# EasyEDA Pro project ProPrj_100MHz��ѹ���̽ͷ_2024-07-25.epro, schematic 100MHz高压差分探头-V6

## Sheets
1 充电管理与隔离变换
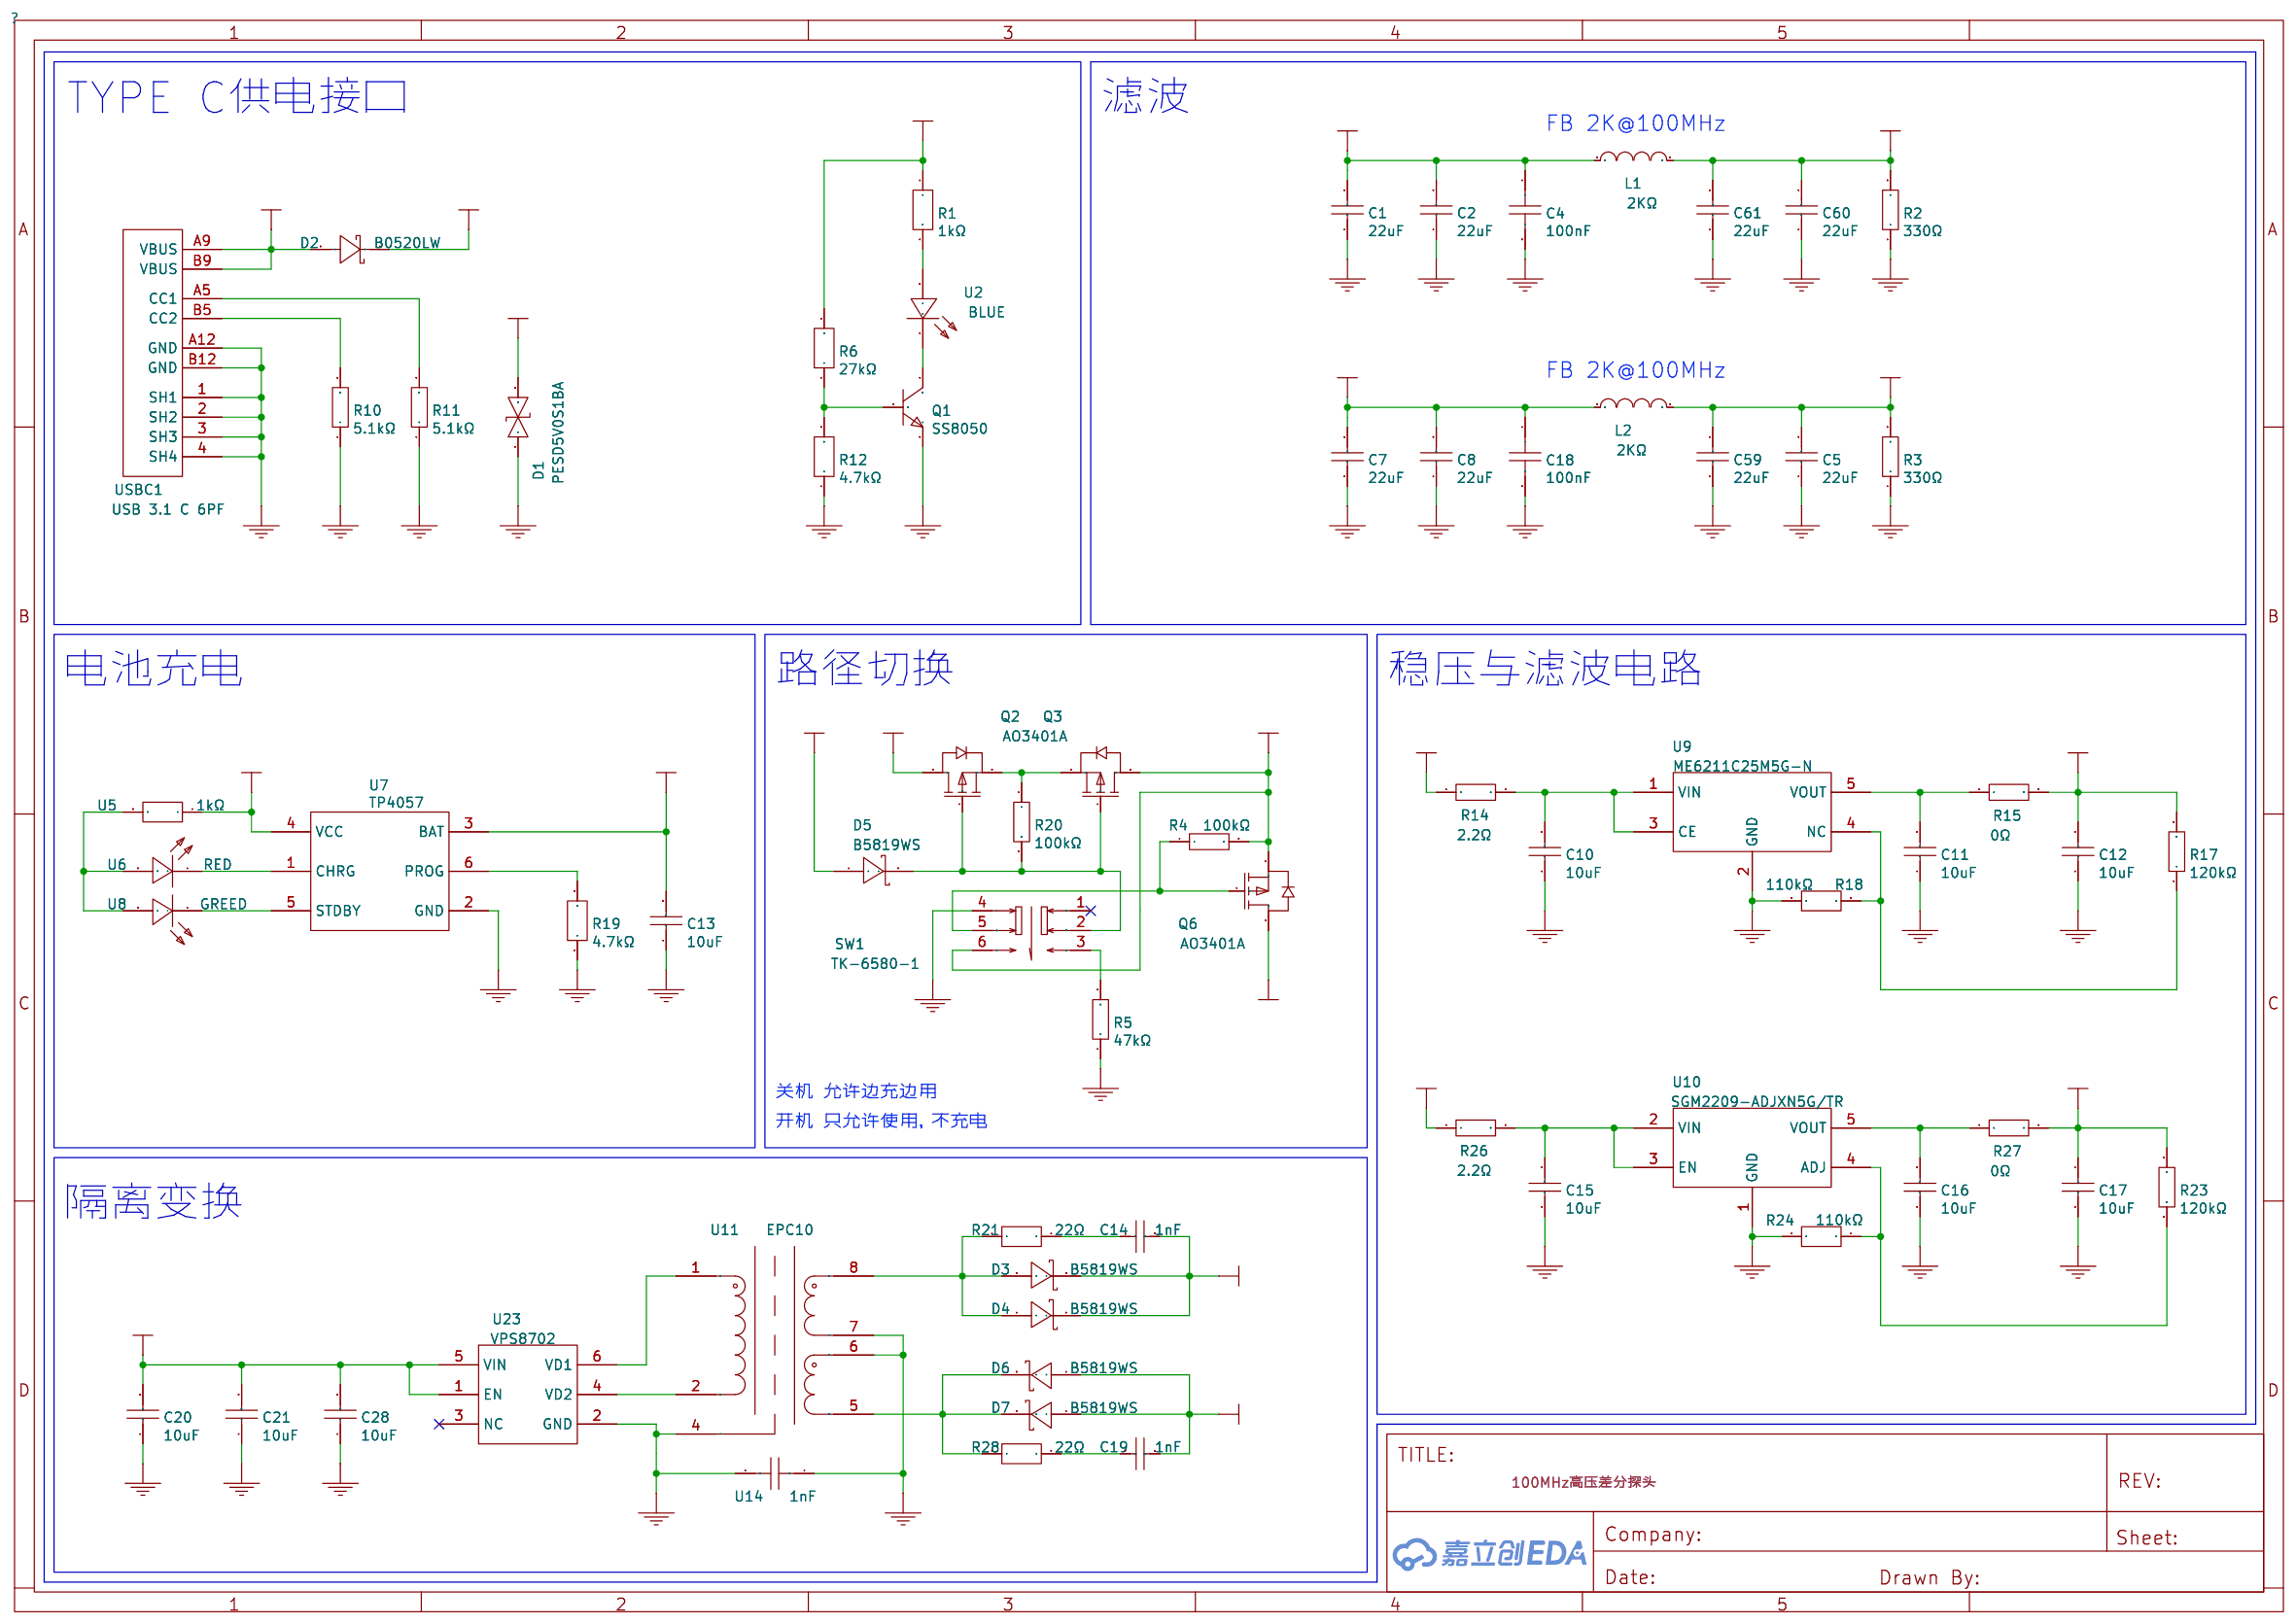
[diagram p0: 充电管理与隔离变换]
2 衰减与放大
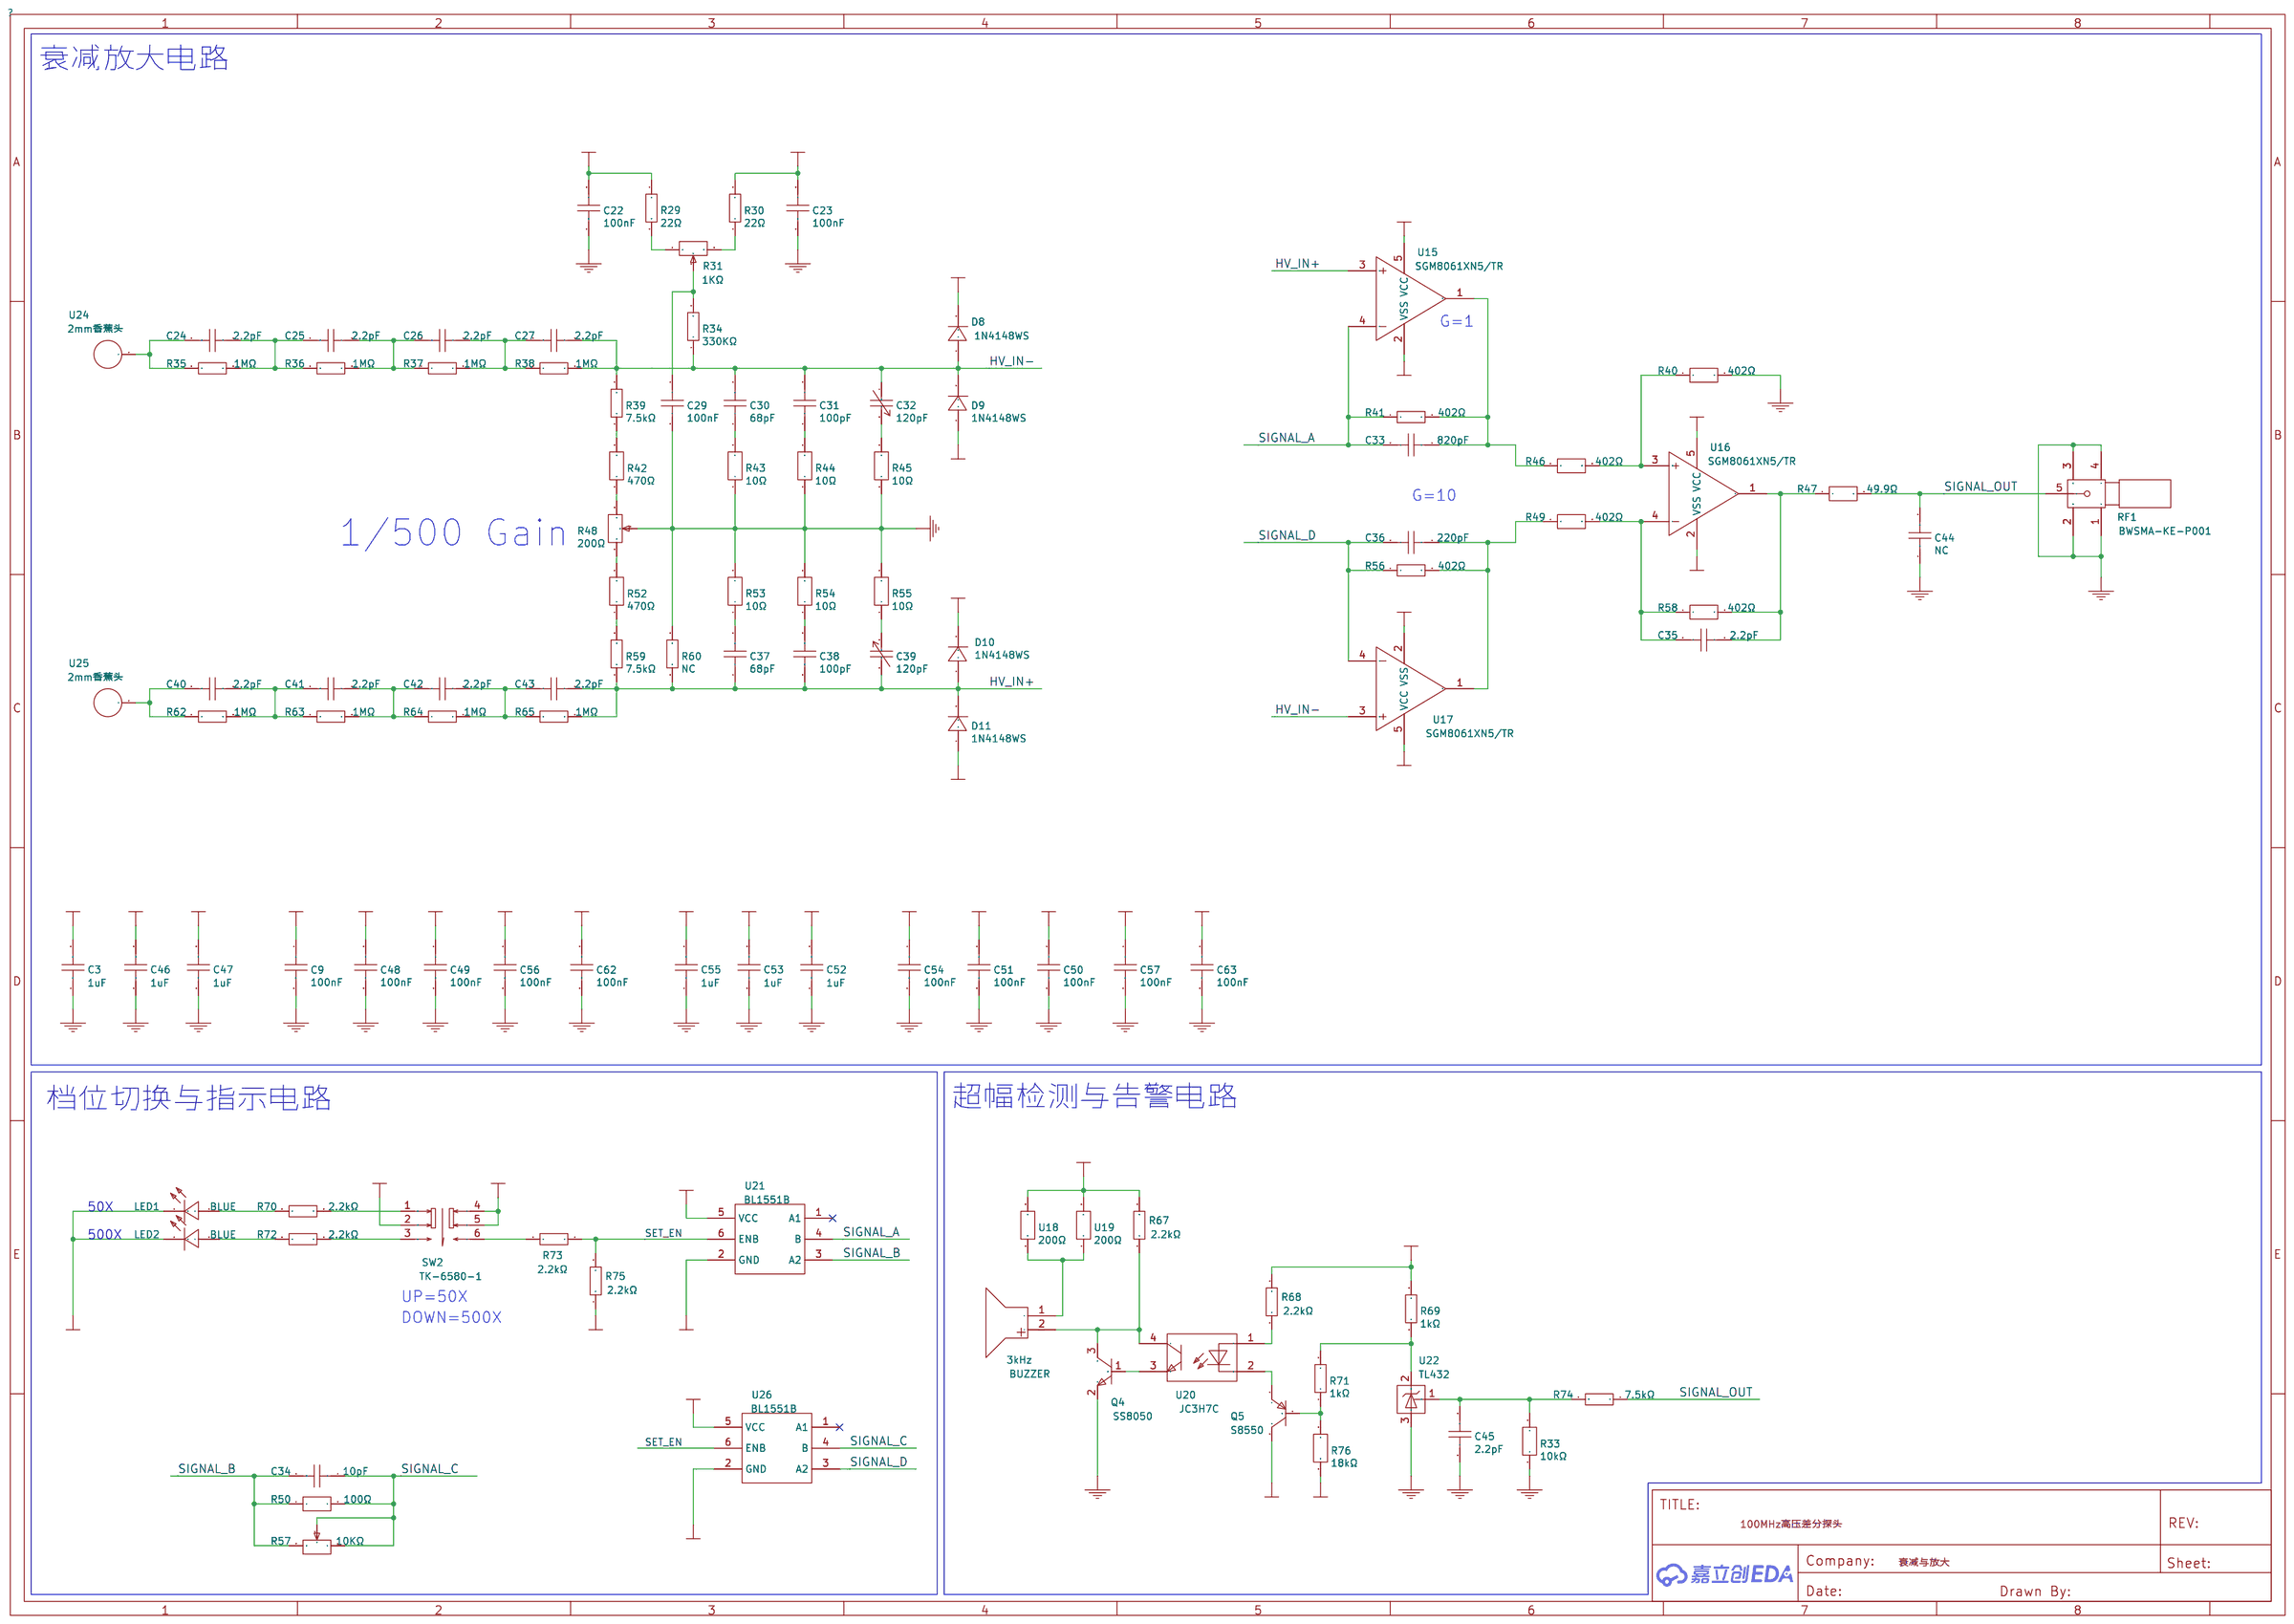
[diagram p1: 衰减与放大]

## Parts
sheet 充电管理与隔离变换
C1  22uF  [C0603]
C2  22uF  [C0603]
C4  100nF  [C0603]
C5  22uF  [C0603]
C7  22uF  [C0603]
C8  22uF  [C0603]
C10  10uF  [C0603]
C11  10uF  [C0603]
C12  10uF  [C0603]
C13  10uF  [C0603]
C14  1nF  [C0603]
C15  10uF  [C0603]
C16  10uF  [C0603]
C17  10uF  [C0603]
C18  100nF  [C0603]
C19  1nF  [C0603]
C20  10uF  [C0603]
C21  10uF  [C0603]
C28  10uF  [C0603]
C59  22uF  [C0603]
C60  22uF  [C0603]
C61  22uF  [C0603]
D1  PESD5V0S1BA  [SOD-323_L1.7-W1.3-LS2.5-FD-1]
D2  B0520LW  [SOD-123FL_L2.7-W1.8-LS3.8-RD]
D3  B5819WS  [SOD-323_L1.7-W1.3-LS2.5-FD-1]
D4  B5819WS  [SOD-323_L1.7-W1.3-LS2.5-FD-1]
D5  B5819WS  [SOD-323_L1.7-W1.3-LS2.5-FD-1]
D6  B5819WS  [SOD-323_L1.7-W1.3-LS2.5-FD-1]
D7  B5819WS  [SOD-323_L1.7-W1.3-LS2.5-FD-1]
L1  2KΩ  [L0603]
L2  2KΩ  [L0603]
Q1  SS8050  [SOT-23_L2.9-W1.3-P1.90-LS2.4-BR]
Q2  AO3401A  [SOT-23_L2.9-W1.3-P1.90-LS2.4-BR]
Q3  AO3401A  [SOT-23_L2.9-W1.3-P1.90-LS2.4-BR]
Q6  AO3401A  [SOT-23_L2.9-W1.3-P1.90-LS2.4-BR]
R1  1kΩ  [R0603]
R2  330Ω  [R0603]
R3  330Ω  [R0603]
R4  100kΩ  [R0603]
R5  47kΩ  [R0603]
R6  27kΩ  [R0603]
R10  5.1kΩ  [R0603]
R11  5.1kΩ  [R0603]
R12  4.7kΩ  [R0603]
R14  2.2Ω  [R0603]
R15  0Ω  [R0603]
R17  120kΩ  [R0603]
R18  110kΩ  [R0603]
R19  4.7kΩ  [R0603]
R20  100kΩ  [R0603]
R21  22Ω  [R0603]
R23  120kΩ  [R0603]
R24  110kΩ  [R0603]
R26  2.2Ω  [R0603]
R27  0Ω  [R0603]
R28  22Ω  [R0603]
SW1  TK-6580-1  [SW-TH_TK-6580-1]
U2  BLUE  [LED0603-RD]
U5  1kΩ  [R0603]
U6  RED  [LED0603-RD]
U7  TP4057  [SOT-23-6_L2.9-W1.6-P0.95-LS2.8-BL]
U8  GREED  [LED0603-RD]
U9  ME6211C25M5G-N  [SOT-23-5_L3.0-W1.7-P0.95-LS2.8-BR]
U10  SGM2209-ADJXN5G/TR  [SOT-23-5_L2.9-W1.6-P0.95-LS2.8-BL]
U11  EPC10  [XFMR-SMD_8P-L10.8-W7.9-P2.00_EPC10]
U14  1nF  [C1808]
U23  VPS8702  [SOT-23-6_L2.9-W1.6-P0.95-LS2.8-BL]
USBC1  USB 3.1 C 6PF  [USB-C-SMD_TYPE-C-USB-13]
sheet 衰减与放大
BUZZER  3kHz  [BUZ-TH_BD9.0-P5.00-D0.6-FD]
C3  1uF  [C0603]
C9  100nF  [C0603]
C22  100nF  [C0603]
C23  100nF  [C0603]
C24  2.2pF  [R1206]
C25  2.2pF  [R1206]
C26  2.2pF  [R1206]
C27  2.2pF  [R1206]
C29  100nF  [C0603]
C30  68pF  [C0603]
C31  100pF  [C0603]
C32  120pF  [CAP-TH_JML06]
C33  820pF  [C0603]
C34  10pF  [C0603]
C35  2.2pF  [C0603]
C36  220pF  [C0603]
C37  68pF  [C0603]
C38  100pF  [C0603]
C39  120pF  [CAP-TH_JML06]
C40  2.2pF  [R1206]
C41  2.2pF  [R1206]
C42  2.2pF  [R1206]
C43  2.2pF  [R1206]
C44  NC  [C0603]
C45  2.2pF  [C0603]
C46  1uF  [C0603]
C47  1uF  [C0603]
C48  100nF  [C0603]
C49  100nF  [C0603]
C50  100nF  [C0603]
C51  100nF  [C0603]
C52  1uF  [C0603]
C53  1uF  [C0603]
C54  100nF  [C0603]
C55  1uF  [C0603]
C56  100nF  [C0603]
C57  100nF  [C0603]
C62  100nF  [C0603]
C63  100nF  [C0603]
D8  1N4148WS  [SOD-323_L1.7-W1.3-LS2.5-FD-1]
D9  1N4148WS  [SOD-323_L1.7-W1.3-LS2.5-FD-1]
D10  1N4148WS  [SOD-323_L1.7-W1.3-LS2.5-FD-1]
D11  1N4148WS  [SOD-323_L1.7-W1.3-LS2.5-FD-1]
LED1  BLUE  [LED0603-RD]
LED2  BLUE  [LED0603-RD]
Q4  SS8050  [SOT-23-3_L2.9-W1.3-P1.90-LS2.4-BR]
Q5  S8550  [SOT-23_L2.9-W1.3-P1.90-LS2.4-BR]
R29  22Ω  [R0603]
R30  22Ω  [R0603]
R31  1KΩ  [RES-ADJ-TH_3296W]
R33  10kΩ  [R0603]
R34  330KΩ  [R0603]
R35  1MΩ  [R1206]
R36  1MΩ  [R1206]
R37  1MΩ  [R1206]
R38  1MΩ  [R1206]
R39  7.5kΩ  [R0603]
R40  402Ω  [R0603]
R41  402Ω  [R0603]
R42  470Ω  [R0603]
R43  10Ω  [R0603]
R44  10Ω  [R0603]
R45  10Ω  [R0603]
R46  402Ω  [R0603]
R47  49.9Ω  [R0603]
R48  200Ω  [RES-ADJ-TH_3296W]
R49  402Ω  [R0603]
R50  100Ω  [R0603]
R52  470Ω  [R0603]
R53  10Ω  [R0603]
R54  10Ω  [R0603]
R55  10Ω  [R0603]
R56  402Ω  [R0603]
R57  10KΩ  [RES-ADJ-TH_3296W]
R58  402Ω  [R0603]
R59  7.5kΩ  [R0603]
R60  NC  [R0603]
R62  1MΩ  [R1206]
R63  1MΩ  [R1206]
R64  1MΩ  [R1206]
R65  1MΩ  [R1206]
R67  2.2kΩ  [R0603]
R68  2.2kΩ  [R0603]
R69  1kΩ  [R0603]
R70  2.2kΩ  [R0603]
R71  1kΩ  [R0603]
R72  2.2kΩ  [R0603]
R73  2.2kΩ  [R0603]
R74  7.5kΩ  [R0603]
R75  2.2kΩ  [R0603]
R76  18kΩ  [R0603]
RF1  BWSMA-KE-P001  [SMA-SMD_BWSMA-KE-P001]
SW2  TK-6580-1  [SW-TH_TK-6580-1]
U15  SGM8061XN5/TR  [SOT-23-5_L3.0-W1.7-P0.95-LS2.8-BL]
U16  SGM8061XN5/TR  [SOT-23-5_L3.0-W1.7-P0.95-LS2.8-BL]
U17  SGM8061XN5/TR  [SOT-23-5_L3.0-W1.7-P0.95-LS2.8-BL]
U18  200Ω  [R0603]
U19  200Ω  [R0603]
U20  JC3H7C  [OPTO-SMD-4_L4.4-W2.7-P1.27-LS7.0-BR]
U21  BL1551B  [SC-70-6_L2.1-W1.3-P0.65-LS2.3-BR]
U22  TL432  [SOT-23_L2.9-W1.3-P1.90-LS2.4-BR]
U24  2mm香蕉头  [2MM香蕉头母座]
U25  2mm香蕉头  [2MM香蕉头母座]
U26  BL1551B  [SC-70-6_L2.1-W1.3-P0.65-LS2.3-BR]

## Library data of the parts
C1 C2 C5 C7 C8 C59-C61 = 22uF: Supplier: LCSC; Manufacturer: YAGEO(国巨); Manufacturer Part: CC0603MRX5R5BB226; Supplier Part: C109448; JLCPCB Part Class: Extended Part
C4 C9 C18 C22 C23 C29 C48-C51 C54 C56 C57 C62 C63 = 100nF: Supplier: LCSC; Supplier Part: C2846678; Manufacturer: FH(风华); Manufacturer Part: 0603B104K160NT
C10-C13 C15-C17 C20 C21 C28 = 10uF: Supplier: LCSC; Manufacturer: YAGEO(国巨); Manufacturer Part: CC0603MRX5R5BB106; Supplier Part: C109454; JLCPCB Part Class: Extended Part
C14 C19 = 1nF: Supplier: LCSC; Supplier Part: C507408; Manufacturer: FH(风华); Manufacturer Part: 0603CG102F500NT; JLCPCB Part Class: Extended Part
D1 = PESD5V0S1BA: Supplier: LCSC; Supplier Part: C2827694; Manufacturer: TECH PUBLIC(台舟); JLCPCB Part Class: Extended Part
D2 = B0520LW: Supplier: LCSC; Supplier Part: C2961212; Manufacturer: CJ(江苏长电/长晶)
D3-D7 = B5819WS: Supplier: LCSC; Manufacturer: CJ(江苏长电/长晶); Supplier Part: C22624; JLCPCB Part Class: Extended Part
L1 L2 = 2KΩ: Supplier: LCSC; Manufacturer: Sunlord(顺络); Manufacturer Part: GZ1608D202TF; Supplier Part: C96696; JLCPCB Part Class: Extended Part
Q1 = SS8050: Supplier: LCSC; Manufacturer: CJ(江苏长电/长晶); Manufacturer Part: SS8050-G; Supplier Part: C164886; JLCPCB Part Class: Extended Part
Q2 Q3 Q6 = AO3401A: Supplier: LCSC; Supplier Part: C347476; Manufacturer: UMW(友台半导体); JLCPCB Part Class: Extended Part
R1 U5 = 1kΩ: Supplier: LCSC; Supplier Part: C728580; Manufacturer: YAGEO(国巨); Manufacturer Part: RT0603BRB071KL; JLCPCB Part Class: Extended Part
R2 R3 = 330Ω: Supplier: LCSC; Manufacturer: YAGEO(国巨); Manufacturer Part: AF0603FR-07330RL; Supplier Part: C144102; JLCPCB Part Class: Extended Part
R4 R20 = 100kΩ: Supplier: LCSC; Manufacturer: YAGEO(国巨); Manufacturer Part: AF0603JR-07100KL; Supplier Part: C144115; JLCPCB Part Class: Extended Part
R5 = 47kΩ: Supplier: LCSC; Manufacturer: YAGEO(国巨); Manufacturer Part: AF0603JR-07100KL; Supplier Part: C144115; JLCPCB Part Class: Extended Part
R6 = 27kΩ: Supplier: LCSC; Supplier Part: C227477; Manufacturer: YAGEO(国巨); Manufacturer Part: AC0603DR-0727KL; JLCPCB Part Class: Extended Part
R10 R11 = 5.1kΩ: Supplier: LCSC; Manufacturer Part: 0603WAF5101T5E; Manufacturer: UNI-ROYAL(厚声); Supplier Part: C23186; JLCPCB Part Class: Basic Part
R12 R19 = 4.7kΩ: Supplier: LCSC; Supplier Part: C705926; Manufacturer: YAGEO(国巨); Manufacturer Part: RT0603CRE074K7L; JLCPCB Part Class: Extended Part
R14 R26 = 2.2Ω: Supplier: LCSC; Manufacturer: UNI-ROYAL(厚声); Manufacturer Part: 0603WAJ022JT5E; Supplier Part: C25226; JLCPCB Part Class: Extended Part
R15 R27 = 0Ω: Supplier: LCSC; Manufacturer: YAGEO(国巨); Manufacturer Part: RC0603FR-070RL; Supplier Part: C100044; JLCPCB Part Class: Extended Part
R17 R23 = 120kΩ: Supplier: LCSC; Manufacturer: UNI-ROYAL(厚声); Manufacturer Part: AC0603FR-07120KL; Supplier Part: C144704; JLCPCB Part Class: Basic Part
R18 R24 = 110kΩ: Supplier: LCSC; Supplier Part: C423090; Manufacturer: UNI-ROYAL(厚声); Manufacturer Part: 0603WAD1103T5E; JLCPCB Part Class: Extended Part
R21 R28 = 22Ω: Supplier: LCSC; Supplier Part: C227468; Manufacturer: YAGEO(国巨); Manufacturer Part: AC0603DR-0722RL; JLCPCB Part Class: Extended Part
SW1 SW2 = TK-6580-1: Supplier: LCSC; Supplier Part: C528778; Manufacturer: Yuandi(元迪); JLCPCB Part Class: Extended Part
LED1 LED2 U2 = BLUE: Supplier: LCSC; Supplier Part: C9900004683; Manufacturer Part: BLUEled-0603; JLCPCB Part Class: Extended Part; Manufacturer: null
U6 = RED: Supplier: LCSC; Supplier Part: C9900005537; Manufacturer: null; Manufacturer Part: RED-LED_0603; JLCPCB Part Class: Extended Part
U7 = TP4057: Supplier: LCSC; Manufacturer: TOPPOWER(南京拓微); Manufacturer Part: TP4057-42-SOT26-R; Supplier Part: C12044; JLCPCB Part Class: Extended Part
U8 = GREED: Supplier: LCSC; Supplier Part: C7429913; Manufacturer: 国星光电; Manufacturer Part: NCD0603O3
U9 = ME6211C25M5G-N: Supplier: LCSC; Supplier Part: C194395; Manufacturer: MICRONE(南京微盟); JLCPCB Part Class: Extended Part
U10 = SGM2209-ADJXN5G/TR: Supplier: LCSC; Supplier Part: C9900008391; Manufacturer: null; JLCPCB Part Class: Extended Part
U11 = EPC10
U14 = 1nF: Supplier: LCSC; Supplier Part: C393742; Manufacturer: IHHEC(禾伸堂); Manufacturer Part: SCC1808X102K502T
U23 = VPS8702: Supplier: LCSC; Supplier Part: C2846905; Manufacturer: VPSC(源特科技); JLCPCB Part Class: Extended Part
USBC1 = USB 3.1 C 6PF: Supplier: LCSC; Supplier Part: C168701; Manufacturer: 精拓金; Manufacturer Part: 918-418K2023S40005; JLCPCB Part Class: Extended Part
BUZZER = 3kHz: Supplier: LCSC; Supplier Part: C96102; Manufacturer: 华能; Manufacturer Part: HNB09A03; JLCPCB Part Class: Extended Part
C3 C46 C47 C52 C53 C55 = 1uF: Supplier: LCSC; Supplier Part: C726554; Manufacturer: YAGEO(国巨); Manufacturer Part: AC0603KRX7R6BB105; JLCPCB Part Class: Extended Part
C24-C27 C40-C43 = 2.2pF: Supplier: LCSC; Supplier Part: C3831038; Manufacturer: Walsin(华新科); Manufacturer Part: 1206N2R2C102CT; JLCPCB Part Class: Extended Part
C30 C37 = 68pF: Supplier: LCSC; Supplier Part: C519457; Manufacturer: YAGEO(国巨); Manufacturer Part: CC0603GRNPO9BN680; JLCPCB Part Class: Extended Part
C31 C38 = 100pF: Supplier: LCSC; Supplier Part: C277507; Manufacturer: YAGEO(国巨); Manufacturer Part: AC0603JRNPO9BN101; JLCPCB Part Class: Extended Part
C32 C39 = 120pF: Supplier: LCSC; JLCPCB Part Class: Extended Part
C33 = CC0603JRNPO9BN821: 容值:820pF;精度:±5%;额定电压:50V;材质(温度系数):NP0;; LCSC Part Name: 820pF ±5% 50V; Supplier Part: C107057; Manufacturer: YAGEO(国巨); Supplier Footprint: 0603; JLCPCB Part Class: Extended Part; Datasheet: https://atta.szlcsc.com/upload/public/pdf/source/20170914/C128857_1505359892143968080.pdf; Supplier: LCSC; Tolerance: ±5%; Voltage Rated: 50V; Temperature Coefficient: NP0
C34 = 22pF: Supplier: LCSC; Supplier Part: C527050; Manufacturer: YAGEO(国巨); Manufacturer Part: CC0603GRNPO0BN100; JLCPCB Part Class: Extended Part
C35 C45 = CC0603CRNPO9BN2R2: 容值:2.2pF;额定电压:50V;材质(温度系数):NP0;; LCSC Part Name: 2.2pF 50V; Supplier Part: C282246; Manufacturer: YAGEO(国巨); Supplier Footprint: 0603; JLCPCB Part Class: Extended Part; Datasheet: https://atta.szlcsc.com/upload/public/pdf/source/20181008/C309499_21CC21451B82C39E3D92150FD6B30293.pdf; Supplier: LCSC; Voltage Rated: 50V; Temperature Coefficient: NP0
C36 = CC0603JRNPO9BN221: 容值:220pF;精度:±5%;额定电压:50V;材质(温度系数):NP0;; LCSC Part Name: 220pF ±5% 50V; Supplier Part: C106210; Manufacturer: YAGEO(国巨); Supplier Footprint: 0603; JLCPCB Part Class: Extended Part; Datasheet: https://atta.szlcsc.com/upload/public/pdf/source/20170505/1493957838062.pdf; Supplier: LCSC; Tolerance: ±5%; Voltage Rated: 50V; Temperature Coefficient: NP0
C44 = CC0603GRNPO0BN100: 容值:10pF;精度:±2%;额定电压:100V;材质(温度系数):NP0;; LCSC Part Name: 10pF ±2% 100V; Supplier Part: C527050; Manufacturer: YAGEO(国巨); Supplier Footprint: 0603; JLCPCB Part Class: Extended Part; Datasheet: https://atta.szlcsc.com/upload/public/pdf/source/20200508/C527050_CCDCD21A4A6D8345D9FA87B546279E01.pdf; Supplier: LCSC; Tolerance: ±2%; Voltage Rated: 100V; Temperature Coefficient: NP0
D8-D11 = 1N4148WS: Supplier: LCSC; Supplier Part: C2843305; Manufacturer: Slkor(萨科微); JLCPCB Part Class: Extended Part
Q4 = SS8050-G_C164886: 晶体管类型:NPN;集电极电流(Ic):1.5A;集射极击穿电压(Vceo):25V;功率(Pd):300mW;直流电流增益(hFE@Ic,Vce):120@100mA,1V;; LCSC Part Name: SS8050-G(RANGE:120-200) L档(120-200); Supplier Part: C164886; Manufacturer: CJ(江苏长电/长晶); Supplier Footprint: SOT-23; JLCPCB Part Class: Extended Part; Datasheet: https://atta.szlcsc.com/upload/public/pdf/source/20180130/C177739_15172974524031323483.pdf; Supplier: LCSC; Transistor Type: NPN; Collector Current (Ic): 1.5A; Collector-Emitter Breakdown Voltage (Vceo): 25V; Power Dissipation (Pd): 300mW; DC Current Gain (hFE@Ic,Vce): 120@100mA,1V; Transition Frequency (fT): 100MHz; Collector Cut-Off Current (Icbo): 100nA; Collector-Emitter Saturation Voltage (VCE(sat)@Ic,Ib): 500mV@800mA,80mA
Q5 = S8550: Supplier: LCSC; Supplier Part: C2983565; Manufacturer: CJ(江苏长电/长晶); Manufacturer Part: AD-SS8550; JLCPCB Part Class: Extended Part
R29 R30 = 22Ω: Supplier: LCSC; Manufacturer: YAGEO(国巨); Manufacturer Part: AC0603DR-0722RL; Supplier Part: C227468; JLCPCB Part Class: Basic Part
R31 = 1KΩ: Supplier: LCSC; JLCPCB Part Class: Extended Part
R33 = 10kΩ: Supplier: LCSC; Supplier Part: C116677; Manufacturer: YAGEO(国巨); Manufacturer Part: AC0603FR-0710KL; JLCPCB Part Class: Extended Part
R34 = 330KΩ: Supplier: LCSC; Manufacturer: YAGEO(国巨); Manufacturer Part: AC0603FR-07330KL; Supplier Part: C144669; JLCPCB Part Class: Extended Part
R35-R38 R62-R65 = 1MΩ: Supplier: LCSC; Manufacturer: YAGEO(国巨); Manufacturer Part: RC1206JR-071ML; Supplier Part: C148194; JLCPCB Part Class: Extended Part
R39 R59 = 7.5kΩ: Supplier: LCSC; Manufacturer: YAGEO(国巨); Manufacturer Part: RC0603JR-077K5L; Supplier Part: C137610; JLCPCB Part Class: Extended Part
R40 R46 R49 R58 = 0603WAF4020T5E: 电阻类型:厚膜电阻;阻值:402Ω;精度:±1%;功率:100mW;最大工作电压:75V;温度系数:±100ppm/℃;; LCSC Part Name: 402Ω ±1% 100mW 厚膜电阻; Supplier Part: C23049; Manufacturer: UNI-ROYAL(厚声); Supplier Footprint: 0603; JLCPCB Part Class: Extended Part; Datasheet: https://atta.szlcsc.com/upload/public/pdf/source/20200306/C422600_1E6D84923E4A46A82E41ADD87F860B5C.pdf; Supplier: LCSC; Type: 厚膜电阻; Tolerance: ±1%; Power(Watts): 100mW; Overload Voltage (Max): 75V; Temperature Coefficient: ±100ppm/℃; Operating Temperature Range: -55℃~+155℃
R41 R56 = 402Ω: Supplier: LCSC; Manufacturer: UNI-ROYAL(厚声); Manufacturer Part: 0603WAF4020T5E; Supplier Part: C23049; JLCPCB Part Class: Extended Part
R42 R52 = 0603WAF4700T5E: 电阻类型:厚膜电阻;阻值:470Ω;精度:±1%;功率:100mW;最大工作电压:75V;温度系数:±100ppm/℃;; LCSC Part Name: 470Ω ±1% 100mW 厚膜电阻; Supplier Part: C23179; Manufacturer: UNI-ROYAL(厚声); Supplier Footprint: 0603; JLCPCB Part Class: Basic Part; Datasheet: https://atta.szlcsc.com/upload/public/pdf/source/20200306/C422600_1E6D84923E4A46A82E41ADD87F860B5C.pdf; Supplier: LCSC; Type: 厚膜电阻; Tolerance: ±1%; Power(Watts): 100mW; Overload Voltage (Max): 75V; Temperature Coefficient: ±100ppm/℃; Operating Temperature Range: -55℃~+155℃
R43-R45 R53-R55 = 10Ω: Supplier: LCSC; Supplier Part: C227440; Manufacturer: YAGEO(国巨); Manufacturer Part: AC0603DR-0710RL; JLCPCB Part Class: Extended Part
R47 = 0603WAF499JT5E: 电阻类型:厚膜电阻;阻值:49.9Ω;精度:±1%;功率:100mW;最大工作电压:75V;温度系数:±100ppm/℃;; LCSC Part Name: 49.9Ω ±1% 100mW 厚膜电阻; Supplier Part: C23185; Manufacturer: UNI-ROYAL(厚声); Supplier Footprint: 0603; JLCPCB Part Class: Basic Part; Datasheet: https://atta.szlcsc.com/upload/public/pdf/source/20200306/C422600_1E6D84923E4A46A82E41ADD87F860B5C.pdf; Supplier: LCSC; Type: 厚膜电阻; Tolerance: ±1%; Power(Watts): 100mW; Overload Voltage (Max): 75V; Temperature Coefficient: ±100ppm/℃; Operating Temperature Range: -55℃~+155℃
R48 = 500Ω: Supplier: LCSC; JLCPCB Part Class: Extended Part
R50 = 100Ω: Supplier: LCSC; Supplier Part: C705891; Manufacturer: YAGEO(国巨); Manufacturer Part: RT0603CRD07100RL; JLCPCB Part Class: Extended Part
R57 = 10KΩ: Supplier: LCSC; JLCPCB Part Class: Extended Part
R60 = NC: Supplier: LCSC; JLCPCB Part Class: Extended Part
R67 R68 R70 R72 R73 R75 = 2.2kΩ: Supplier: LCSC; Manufacturer: UNI-ROYAL(厚声); Manufacturer Part: 0603WAF2201T5E; Supplier Part: C4190; JLCPCB Part Class: Basic Part
R69 R71 = 1kΩ: Supplier: LCSC; Manufacturer Part: RC0603FR-071KL; Manufacturer: YAGEO(国巨); Supplier Part: C22548; JLCPCB Part Class: Extended Part
R74 = 7.5kΩ: Supplier: LCSC; Manufacturer: YAGEO(国巨); Manufacturer Part: RC0603JR-077K5L; Supplier Part: C137610; JLCPCB Part Class: Basic Part
R76 = 18kΩ: Supplier: LCSC; Supplier Part: C705818; Manufacturer: YAGEO(国巨); Manufacturer Part: RT0603BRE0718KL; JLCPCB Part Class: Extended Part
RF1 = BWSMA-KE-P001: Supplier: LCSC; Supplier Part: C496550; Manufacturer: BAT WIRELESS(蝙蝠无线); JLCPCB Part Class: Extended Part
U15-U17 = SGM8061XN5/TR: Supplier: LCSC; Supplier Part: C90963; Manufacturer: SGMICRO(圣邦微); JLCPCB Part Class: Extended Part
U18 U19 = 200Ω: Supplier: LCSC; Supplier Part: C861216; Manufacturer: YAGEO(国巨); Manufacturer Part: RT0603BRD07200RL; JLCPCB Part Class: Extended Part
U20 = JC3H7C: Supplier: LCSC; Manufacturer: null; Manufacturer Part: JC3H7; Supplier Part: C55287; JLCPCB Part Class: Extended Part
U21 U26 = BL1551B: Supplier: LCSC; Supplier Part: C2944066; Manufacturer: BL(上海贝岭); JLCPCB Part Class: Extended Part
U22 = TL432: Supplier: LCSC; Supplier Part: C3025161; Manufacturer: GOODWORK(固得沃克); JLCPCB Part Class: Extended Part
U24 U25 = 2mm香蕉头

## Nets
+2.5V: C3.2 C9.1 C12.2 C23.1 C46.2 C47.2 C48.1 C49.1 C56.1 C62.1 D8.2 D10.2 R15.2 R17.2 R30.2 SW2.4 SW2.5 U15.5(VCC) U16.5(VCC) U17.5(VCC) U21.5(VCC) U26.5(VCC)
+4.5V: C60.2 C61.2 L1.2 R2.2 R14.1 R68.2 R69.2 SW2.2
+5V: C20.2 C21.2 C28.2 D2.1(K) Q3.3(D) Q6.2(S) R1.1 R4.2 R6.2 R67.2 SW1.6 U18.2 U19.2 U23.1(EN) U23.5(VIN)
+VCC: C1.2 C2.2 C4.1 C14.2 D3.2(K) D4.2(K) L1.1
-2.5V: C17.2 C22.1 C50.1 C51.1 C52.2 C53.2 C54.1 C55.2 C57.1 C63.1 D9.1 D11.1 R23.2 R27.2 R29.1 R75.1 U15.2(VSS) U16.2(VSS) U17.2(VSS) U21.2(GND) U26.2(GND)
-4.5V: C5.2 C59.2 L2.2 LED1.1(K) LED2.1(K) Q5.3(C) R3.2 R26.1 R76.1
-VCC: C7.2 C8.2 C18.1 C19.2 D6.1(A) D7.1(A) L2.1
GND: C1.1 C2.1 C3.1 C4.2 C5.1 C7.1 C8.1 C9.2 C10.1 C11.1 C12.1 C15.1 C16.1 C17.1 C18.2 C22.2 C23.2 C29.2 C44.1 C45.2 C46.1 C47.1 C48.2 C49.2 C50.2 C51.2 C52.1 C53.1 C54.2 C55.1 C56.2 C57.2 C59.1 C60.1 C61.1 C62.2 C63.2 R2.1 R3.1 R18.2 R24.2 R33.1 R40.2 R43.1 R44.1 R45.1 R48.2 R53.2 R54.2 R55.2 R60.2 RF1.1 RF1.2 RF1.3 RF1.4 U9.2(GND) U10.1(GND) U11.6 U11.7 U14.1 U22.3(A)
PGND: C13.1 C20.1 C21.1 C28.1 D1.1 Q1.2(E) Q4.2(E) R5.1 R10.1 R11.1 R12.1 R19.1 SW1.4 U7.2(GND) U11.4 U14.2 U23.2(GND) USBC1.1(SH1) USBC1.2(SH2) USBC1.3(SH3) USBC1.4(SH4) USBC1.A12(GND) USBC1.B12(GND)
VBUS: D1.2 D2.2(A) D5.1(A) USBC1.A9(VBUS) USBC1.B9(VBUS)
BAT+: C13.2 Q2.3(D) U7.3(BAT)
BAT_CHRG: Q6.3(D) U5.1 U7.4(VCC)
HV_IN+: C37.1 C38.1 C39.1 C43.1 D10.1 D11.2 R59.1 R60.1 R65.2 U15.3
HV_IN-: C27.1 C30.2 C31.2 C32.1 D8.1 D9.2 R34.1 R38.2 R39.2 U17.3
SET_EN: R73.1 R75.2 U21.6(ENB) U26.6(ENB)
SIGNAL_A: C33.2 R41.1 U15.4 U21.4(B)
SIGNAL_B: C34.2 R50.1 R57.3 U21.3(A2)
SIGNAL_C: C34.1 R50.2 R57.1 R57.2 U26.4(B)
SIGNAL_D: C36.2 R56.1 U17.4 U26.3(A2)
SIGNAL_OUT: C44.2 R47.2 R74.1 RF1.5
$1N9: R10.2 USBC1.B5(CC2)
$1N10: R11.2 USBC1.A5(CC1)
$1N17: D6.2(K) D7.2(K) R28.1 U11.5
$1N18: C14.1 R21.2
$1N19: C19.1 R28.2
$1N29: R19.2 U7.6(PROG)
$1N31: U6.1 U7.1(CHRG)
$1N32: U7.5(STDBY) U8.1(-)
$1N34: U5.2 U6.2 U8.2(+)
$1N35: Q2.2(S) Q3.2(S) R20.1
$1N37: D3.1(A) D4.1(A) R21.1 U11.8
$1N38: Q1.3(C) U2.1(K)
$1N39: Q1.1(B) R6.1 R12.2
$1N42: R1.2 U2.2(A)
$1N44: D5.2(K) Q2.1(G) Q3.1(G) R20.2 SW1.2
$1N50: U11.2 U23.4(VD2)
$1N51: U11.1 U23.6(VD1)
$1N66: C10.2 R14.2 U9.1(VIN) U9.3(CE)
$1N70: C11.2 R15.1 U9.5(VOUT)
$1N78: C15.2 R26.2 U10.2(VIN) U10.3(EN)
$1N80: C16.2 R27.1 U10.5(VOUT)
$1N84: R17.1 R18.1 U9.4(NC)
$1N85: R23.1 R24.1 U10.4(ADJ)
$1N87: R5.2 SW1.3
$1N88: Q6.1(G) R4.1 SW1.5
$2N9: C35.1 R47.1 R58.2 U16.1
$2N10: C36.1 R49.1 R56.2 U17.1
$2N11: C33.1 R41.2 R46.1 U15.1
$2N13: R40.1 R46.2 U16.3
$2N15: C35.2 R49.2 R58.1 U16.4
$2N33: R30.1 R31.3
$2N35: C29.1 R31.2 R34.2
$2N36: R29.2 R31.1
$2N40: C32.2 R45.2
$2N44: C24.2 R35.1 U24.1
$2N45: C40.2 R62.1 U25.1
$2N46: R52.1 R59.2
$2N47: R48.1 R52.2
$2N48: C40.1 C41.2 R62.2 R63.1
$2N50: C41.1 C42.2 R63.2 R64.1
$2N51: C42.1 C43.2 R64.2 R65.1
$2N55: R42.1 R48.3
$2N56: R39.1 R42.2
$2N57: C26.1 C27.2 R37.2 R38.1
$2N58: C25.1 C26.2 R36.2 R37.1
$2N60: C24.1 C25.2 R35.2 R36.1
$2N70: R73.2 SW2.6
$2N71: R70.1 SW2.1
$2N72: R72.1 SW2.3
$2N74: LED1.2(A) R70.2
$2N75: LED2.2(A) R72.2
$2N78: C45.1 R33.2 R74.2 U22.1(R)
$2N83: R69.1 R71.2 U22.2(K)
$2N86: R68.1 U20.1
$2N88: Q5.1(B) R71.1 R76.2
$2N90: Q4.1(B) U20.3
$2N92: BUZZER.1(+) U18.1 U19.1
$2N93: BUZZER.2(-) Q4.3(C) R67.1 U20.4
$2N95: C31.1 R44.2
$2N96: C37.2 R53.1
$2N97: C30.1 R43.2
$2N98: C38.2 R54.1
$2N127: C39.2 R55.1
$2N12584: Q5.2(E) U20.2

Not connected (* = marked no-connect by the designer): SW1 1*; U21 1(A1)*; U23 3(NC)*; U26 1(A1)*

## Notes on the sheets
sheet 1
- TYPE C供电接口
- 滤波
- FB 2K@100MHz
- FB 2K@100MHz
- 电池充电
- 路径切换
- 稳压与滤波电路
- 关机 允许边充边用
- 开机 只允许使用，不充电
- 隔离变换
sheet 2
- 衰减放大电路
- G=1
- G=10
- 1/500 Gain
- 档位切换与指示电路
- 超幅检测与告警电路
- 50X
- 500X
- UP=50X
- DOWN=500X
